# Altium schematic sheet LCD .SchDoc: LCD
size A3; Author: Vi Tín; SheetNumber: 9; SheetTotal: 15
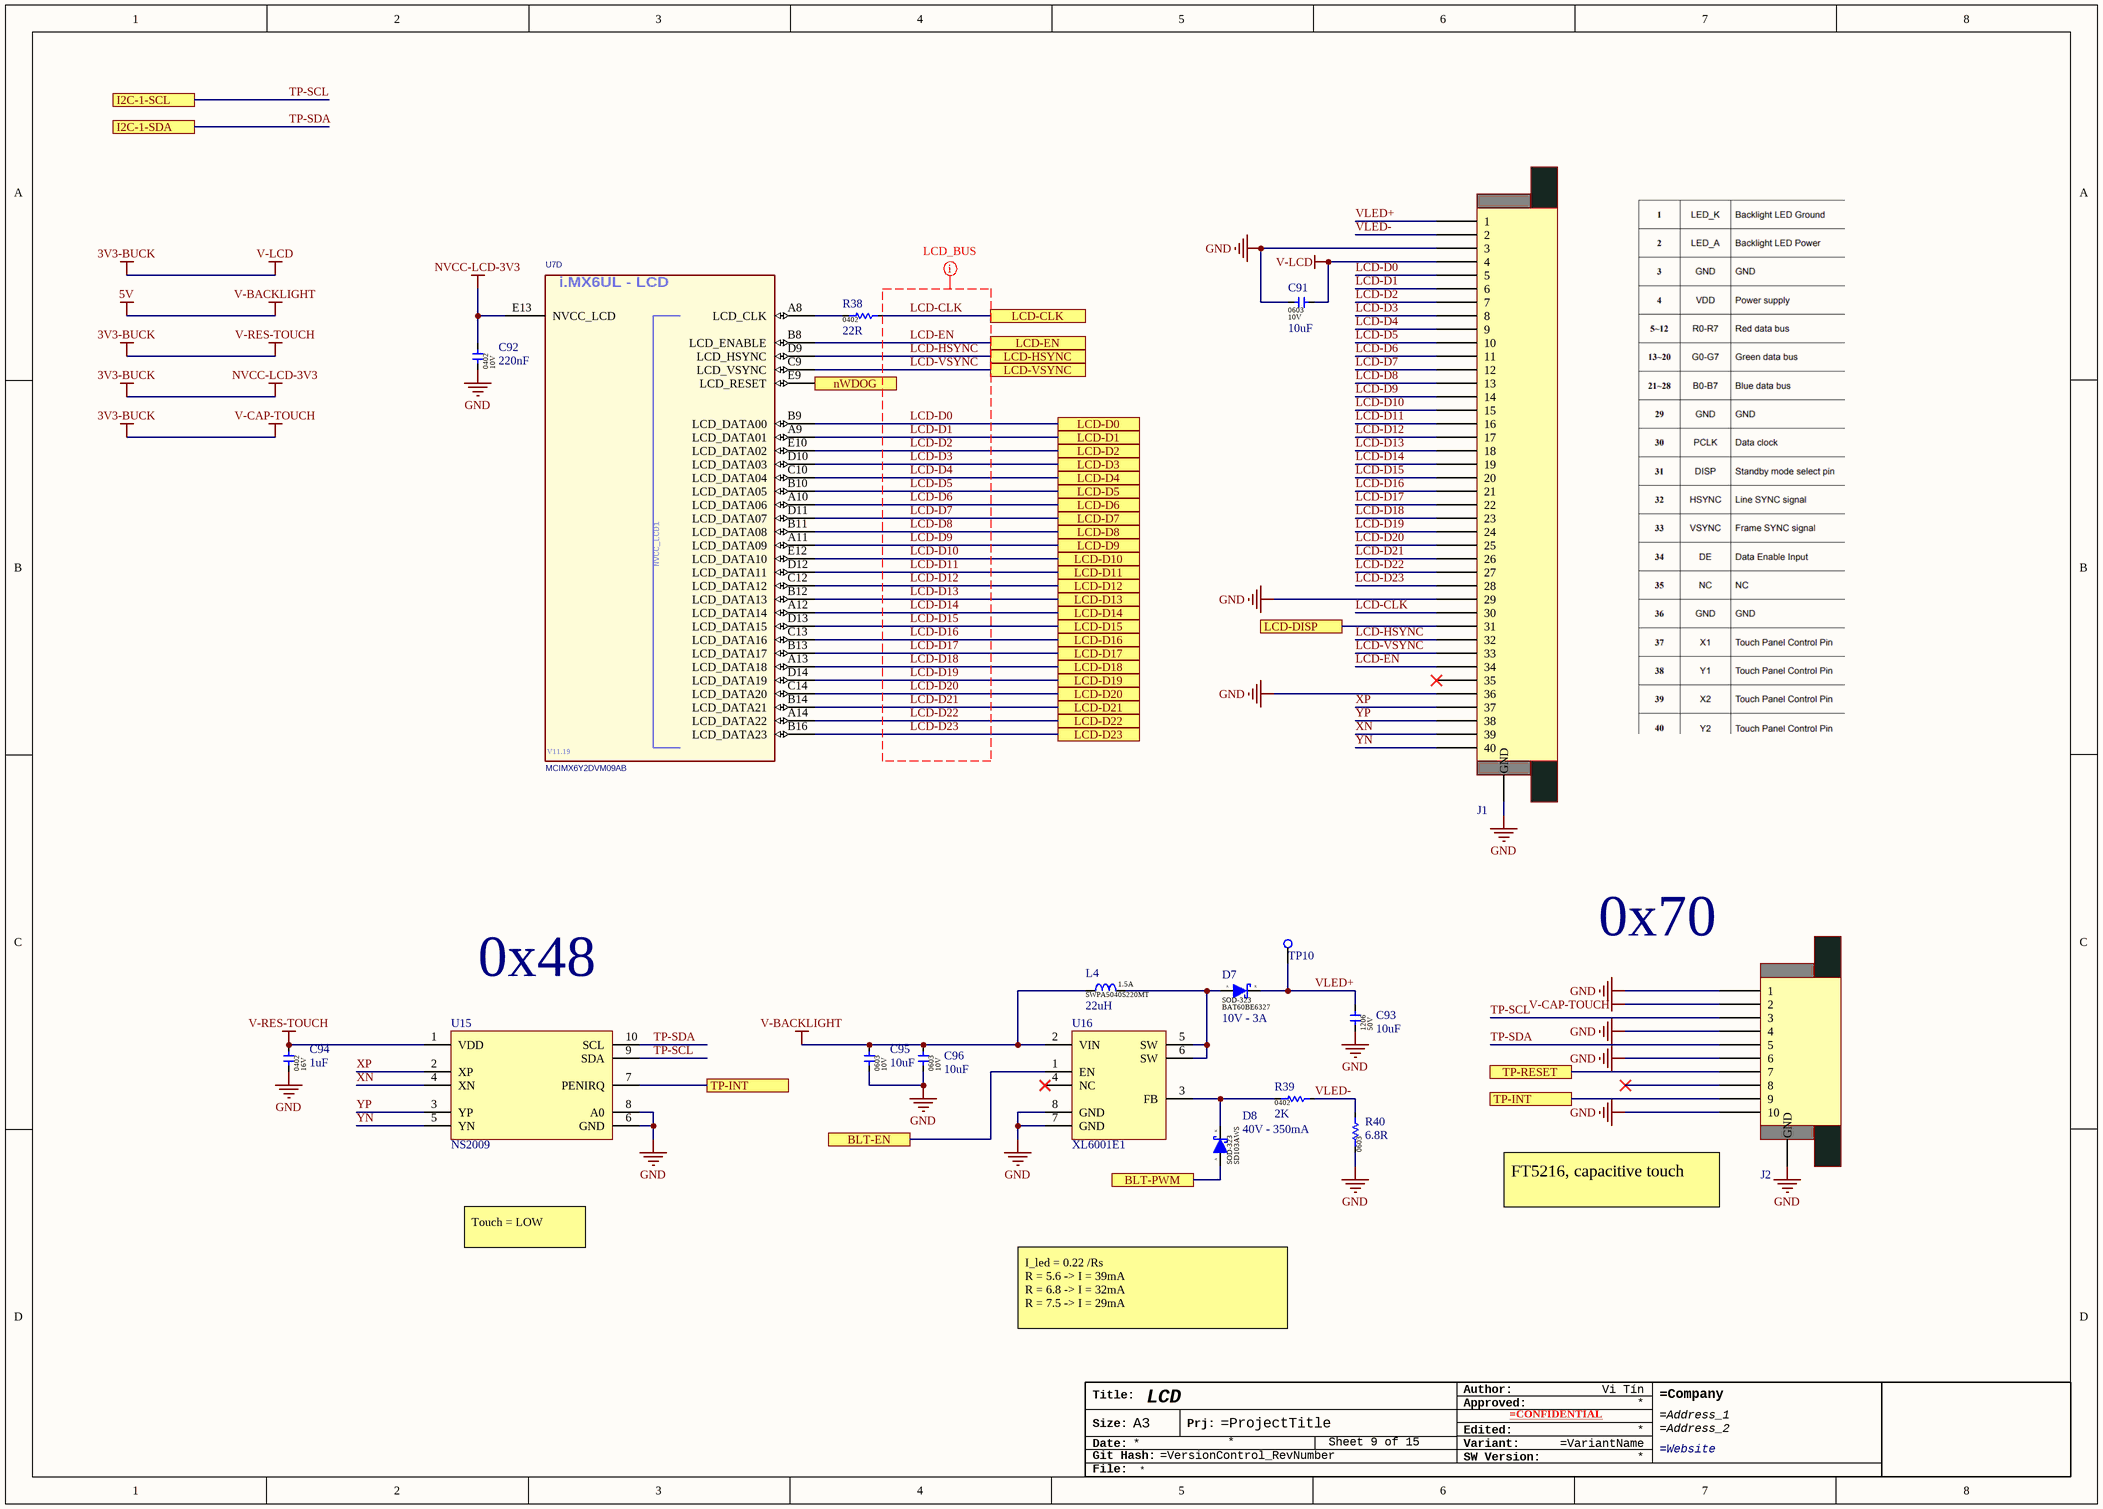
[diagram p0: LCD .SchDoc]

## Parts
*?  TitleBlock_Generic  (value not drawn)  (graphical)
C91  10uF  [CAP-0603]
C92  220nF  [CAP-0402]
C93  10uF  [CAP-1206]
C94  1uF  [CAP-0402]
C95  10uF  [CAP-0603]
C96  10uF  [CAP-0603]
D7  10V - 3A  [SOD323 (UNI)]
D8  40V - 350mA  [SOD323 (UNI)]
J1  AFC07-S40ECC-00  [FPC - 40P, 0.5mm, top]  (value not drawn)
J2  AFC07-S10FCC-00  [FPC - 10P, 0.5mm, bot]  (value not drawn)
L4  22uH  [IND-5040]
R38  22R  [RES-0402]
R39  2K  [RES-0402]
R40  6.8R  [RES-0603]
TP10  N/A  [Test point]  (value not drawn)  (no BOM)
U7  MCIMX6Y2DVM09AB  [IMX6ULL]  (part D of 11)
U15  NS2009  [MSOP-10]
U16  XL6001E1  [SOP-8]

## Ports
BLT-EN, BLT-PWM, I2C-1-SCL, I2C-1-SDA, LCD-CLK, LCD-D0, LCD-D1, LCD-D2, LCD-D3, LCD-D4, LCD-D5, LCD-D6, LCD-D7, LCD-D8, LCD-D9, LCD-D10, LCD-D11, LCD-D12, LCD-D13, LCD-D14, LCD-D15, LCD-D16, LCD-D17, LCD-D18, LCD-D19, LCD-D20, LCD-D21, LCD-D22, LCD-D23, LCD-DISP, LCD-EN, LCD-HSYNC, LCD-VSYNC, nWDOG, TP-INT, TP-RESET

## Nets
3V3-BUCK: C91.2 C92.2 C94.2 J1.4 J2.2 U7.E13(NVCC_LCD) U15.1(VDD)  [also labelled NVCC-LCD-3V3, V-CAP-TOUCH, V-LCD, V-RES-TOUCH]
5V: C95.2 C96.2 L4.1 U16.2(VIN)  [also labelled V-BACKLIGHT]
GND: C91.1 C92.1 C93.1 C94.1 C95.1 C96.1 J1.0(GND) J1.3 J1.29 J1.36 J2.0(GND) J2.1 J2.4 J2.6 J2.10 R40.1 U15.6(GND) U15.8(A0) U16.7(GND) U16.8(GND)
BLT-EN: U16.1(EN) ; port BLT-EN
BLT-PWM: D8.2(Anode) ; port BLT-PWM
LCD-CLK: J1.30 R38.2 ; port LCD-CLK
LCD-D0: J1.5 U7.B9(LCD_DATA00) ; port LCD-D0
LCD-D1: J1.6 U7.A9(LCD_DATA01) ; port LCD-D1
LCD-D2: J1.7 U7.E10(LCD_DATA02) ; port LCD-D2
LCD-D3: J1.8 U7.D10(LCD_DATA03) ; port LCD-D3
LCD-D4: J1.9 U7.C10(LCD_DATA04) ; port LCD-D4
LCD-D5: J1.10 U7.B10(LCD_DATA05) ; port LCD-D5
LCD-D6: J1.11 U7.A10(LCD_DATA06) ; port LCD-D6
LCD-D7: J1.12 U7.D11(LCD_DATA07) ; port LCD-D7
LCD-D8: J1.13 U7.B11(LCD_DATA08) ; port LCD-D8
LCD-D9: J1.14 U7.A11(LCD_DATA09) ; port LCD-D9
LCD-D10: J1.15 U7.E12(LCD_DATA10) ; port LCD-D10
LCD-D11: J1.16 U7.D12(LCD_DATA11) ; port LCD-D11
LCD-D12: J1.17 U7.C12(LCD_DATA12) ; port LCD-D12
LCD-D13: J1.18 U7.B12(LCD_DATA13) ; port LCD-D13
LCD-D14: J1.19 U7.A12(LCD_DATA14) ; port LCD-D14
LCD-D15: J1.20 U7.D13(LCD_DATA15) ; port LCD-D15
LCD-D16: J1.21 U7.C13(LCD_DATA16) ; port LCD-D16
LCD-D17: J1.22 U7.B13(LCD_DATA17) ; port LCD-D17
LCD-D18: J1.23 U7.A13(LCD_DATA18) ; port LCD-D18
LCD-D19: J1.24 U7.D14(LCD_DATA19) ; port LCD-D19
LCD-D20: J1.25 U7.C14(LCD_DATA20) ; port LCD-D20
LCD-D21: J1.26 U7.B14(LCD_DATA21) ; port LCD-D21
LCD-D22: J1.27 U7.A14(LCD_DATA22) ; port LCD-D22
LCD-D23: J1.28 U7.B16(LCD_DATA23) ; port LCD-D23
LCD-DISP: J1.31 ; port LCD-DISP
LCD-EN: J1.34 U7.B8(LCD_ENABLE) ; port LCD-EN
LCD-HSYNC: J1.32 U7.D9(LCD_HSYNC) ; port LCD-HSYNC
LCD-VSYNC: J1.33 U7.C9(LCD_VSYNC) ; port LCD-VSYNC
nWDOG: U7.E9(LCD_RESET) ; port nWDOG
TP-INT: J2.9 U15.7(PENIRQ) ; port TP-INT
TP-RESET: J2.7 ; port TP-RESET
TP-SCL: J2.3 U15.9(SDA) ; port I2C-1-SCL
TP-SDA: J2.5 U15.10(SCL) ; port I2C-1-SDA
VLED+: C93.2 D7.1(Cathode) J1.1 TP10.1
VLED-: J1.2 R39.2 R40.2
XN: J1.39 U15.4(XN)
XP: J1.37 U15.2(XP)
YN: J1.40 U15.5(YN)
YP: J1.38 U15.3(YP)
NetD7_2: D7.2(Anode) L4.2 U16.5(SW) U16.6(SW)
NetD8_1: D8.1(Cathode) R39.1 U16.3(FB)
NetR38_1: R38.1 U7.A8(LCD_CLK)

Not connected (* = marked no-connect by the designer): J1 35*; J2 8*; U16 4(NC)*

## Layout directives
net class LCD_BUS: LCD-CLK, LCD-D0, LCD-D1, LCD-D2, LCD-D3, LCD-D4, LCD-D5, LCD-D6, LCD-D7, LCD-D8, LCD-D9, LCD-D10, LCD-D11, LCD-D12, LCD-D13, LCD-D14, LCD-D15, LCD-D16, LCD-D17, LCD-D18, LCD-D19, LCD-D20, LCD-D21, LCD-D22, LCD-D23, LCD-EN, LCD-HSYNC, LCD-VSYNC

## Notes on the sheet
- 0x48
- 0x70
- Touch = LOW
- (near J2) FT5216, capacitive touch
- I_led = 0.22 /Rs
  R = 5.6 -> I = 39mA
  R = 6.8 -> I = 32mA
  R = 7.5 -> I = 29mA
- (in symbol BAT60BE6327) A; K
- (in symbol MCIMX6Y2DVM09AB, part D) i.MX6UL - LCD; NVCC_LCD1; V11.19
- (in symbol SD103AWS) K; A
- (in symbol TitleBlock_Generic) Author:; Title:; Approved:; Size:; A3; Prj:; Edited:; Date:; Variant:; SW Version:; Git Hash:; File:

## Library data of the parts
C91 C95 C96 = 0603X106M100CT: 10uF ±20% 10V X5R 0603 Multilayer Ceramic Capacitors MLCC - SMD/SMT RoHS; Manufacture: WALSIN; Package / Case: 0402; Component type: Capacitor; Manufacture part: 0603X106M100CT; Capacitor value: 10uF; Voltage: 10V; Package: 0603
C92 = 0402X224J100CT: 220nF ±5% 10V X5R 0402 Multilayer Ceramic Capacitors MLCC - SMD/SMT RoHS; Manufacture: WALSIN; Package / Case: 0402; Component type: Capacitor; Manufacture part: 0402X224J100CT; Capacitor value: 220nF; Voltage: 10V; Package: 0402
C93 = 1206X106K500CT: 10uF ±10% 50V X5R 1206 Multilayer Ceramic Capacitors MLCC - SMD/SMT RoHS; Manufacture: WALSIN; Package / Case: 0402; Component type: Capacitor; Manufacture part: 1206X106K500CT; Capacitor value: 10uF; Voltage: 50V; Package: 1206
C94 = 0402X105K160CT: 1uF ±10% 16V X5R 0402 Multilayer Ceramic Capacitors MLCC - SMD/SMT RoHS; Manufacture: WALSIN; Package / Case: 0402; Component type: Capacitor; Manufacture part: 0402X105K160CT; Capacitor value: 1uF; Voltage: 16V; Package: 0402
D7 = BAT60BE6327: 10V 3A 600mV @ 1A SOD-323 Schottky Barrier Diodes (SBD) RoHS; Manufacture: Infineon Technologies; Manufacture part: BAT60BE6327; Type: Schottky diode; Diode value: 10V - 3A; Package: SOD-323; Datasheet: https://datasheet.lcsc.com/lcsc/1809021231_Infineon-Technologies-BAT60BE6327_C91059.pdf
D8 = SD103AWS: 40V 350mA 600mV @ 200mA SOD-323 Schottky Barrier Diodes (SBD) ROHS; Manufacture: Shikues; Manufacture part: SD103AWS; Type: Schottky diode; Diode value: 40V - 350mA; Package: SOD-323; Datasheet: https://datasheet.lcsc.com/lcsc/1809211226_Shikues-SD103AWS_C109204.pdf
J1 = AFC07-S40ECC-00: Contact,Top 40 0.020"（0.50mm） 0.079"（2.00mm） Slide Lock 40P FFC, FPC Connectors RoHS; Manufacture: JUSHUO; Manufacture part: AFC07-S40ECC-00; Type: FPC; Datasheet: https://datasheet.lcsc.com/lcsc/JUSHUO-AFC07-S40ECC-00_C11097.pdf
J2 = AFC07-S10FCC-00: Slide Lock Contact,Bottom 10P FFC/FPC Connectors ROHS; Manufacture: JUSHUO; Manufacture part: AFC07-S10FCC-00; Type: FPC; Datasheet: https://datasheet.lcsc.com/lcsc/1811021314_JUSHUO-AFC07-S10FCC-00_C11050.pdf
L4 = SWPA5040S220MT: Inductor 22uH ±20% 1.5A, 5.0x5.0x4; Manufacture: SUNLORD; DCR: 0.168 Ω; Manufacture part: SWPA5040S220MT; Inductance value: 22uH; Irms max: 1.5A; Package: 5040
R38 = WR04X22R0FTL: 22Ω ±1% 1/16W ±100ppm/℃ 0402 Chip Resistor - Surface Mount RoHS; Manufacture: WALSIN; Package / Case: 0201; Component type: Resistor; Manufacture part: WR04X22R0FTL; Resistor value: 22R; Package: 0402
R39 = WR04X2001FTL: 2kΩ ±1% 1/16W ±100ppm/℃ 0402 Chip Resistor - Surface Mount RoHS; Manufacture: WALSIN; Package / Case: 0201; Component type: Resistor; Manufacture part: WR04X2001FTL; Resistor value: 2K; Package: 0402
R40 = WR06W6R80FTL: 6.8Ω ±1% ±1% 0.1W -200ppm/℃~+400ppm/℃ 0603 Chip Resistor - Surface Mount RoHS; Manufacture: WALSIN; Package / Case: 0201; Component type: Resistor; Manufacture part: WR06W6R80FTL; Resistor value: 6.8R; Package: 0603
TP10 = N/A: A point used for measure.; Manufacture part: N/A; Manufacture: N/A; Type: Test point
U7 = MCIMX6Y2DVM09AB: Microprocessors - MPU i.MX 32-bit MPU ARM -A7 900MHz, 0.8mm Pitch; Manufacture: NXP Semiconductors; CLASS: IC; CAD_APPROVED: Yes; PRE_APN: 330-76997; MFG_PN01: PCIMX6G3CVM05AA; MFG_NAME01: FREESCALE SEMICONDUCTOR; AGILE_PN: TMP-WF-23753; HEIGHT: 1.37 MM; ROHS: Yes; Manufacture part: MCIMX6Y2DVM09AB; Package: MAPBGA-289 (14x14); Datasheet: https://www.mouser.vn/datasheet/2/302/IMX6ULLCEC-1126331.pdf
U15 = NS2009: MSOP-10 Touch Screen Controllers RoHS; Manufacture: Shenzhen Nsiway Tech; Manufacture part: NS2009; Package: MSOP-10; Datasheet: https://datasheet.lcsc.com/lcsc/1810181630_Shenzhen-Nsiway-Tech-NS2009_C219024.pdf
U16 = XL6001E1: SOIC-8_150mil LED Drivers RoHS; Manufacture: XLSEMI; Manufacture part: XL6001E1; Package: SOP-8; Datasheet: https://datasheet.lcsc.com/lcsc/1809191820_XLSEMI-XL6001E1_C73343.pdf
*? = TitleBlock_Generic: Manufacture part: TitleBlock_Generic; Manufacture: N/A; Type: Graphic